# EasyEDA schematic SCH_MdN_Sensor_Contaminacion_Movil_2025-03-27.json

## Sheets
1 Sensor_Cont_Movil_Medialab: TITLE: Sheet_1; REV: 1.0; Date: 2025-01-21; Sheet: 1/1; Company: Your Company
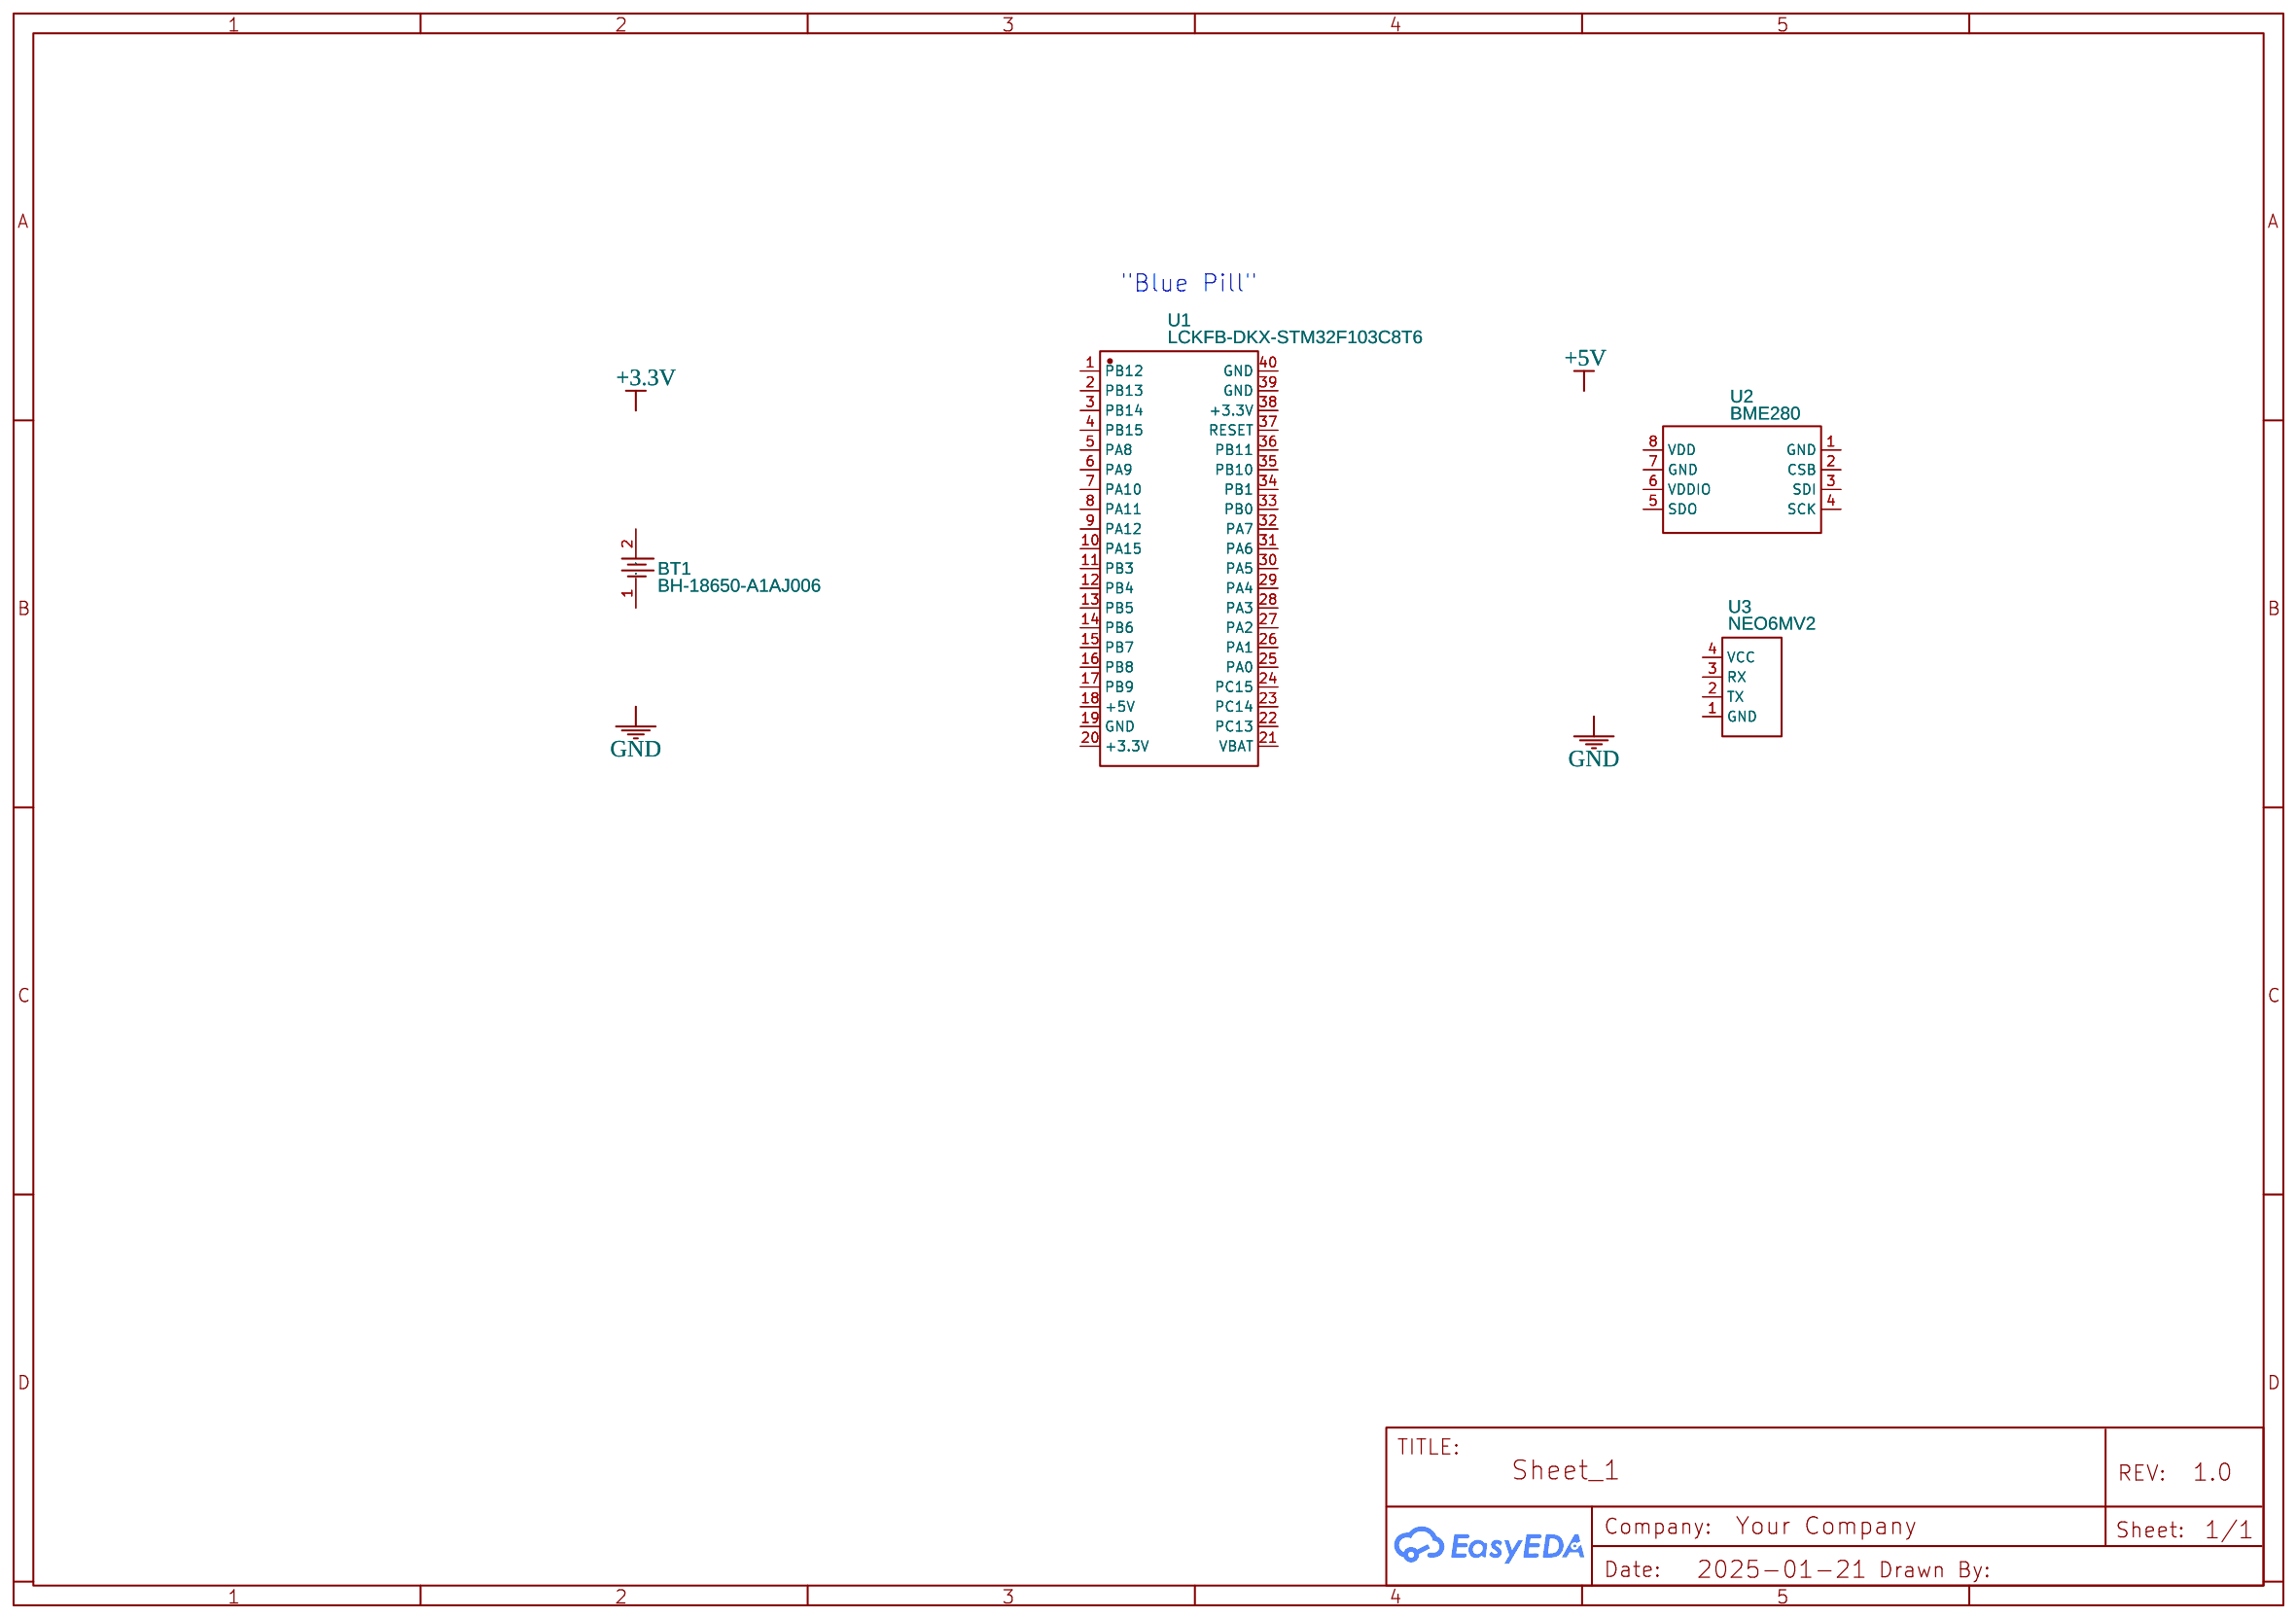
[diagram p0: Sensor_Cont_Movil_Medialab]
2 Sensor_Cont_Movil_MdN
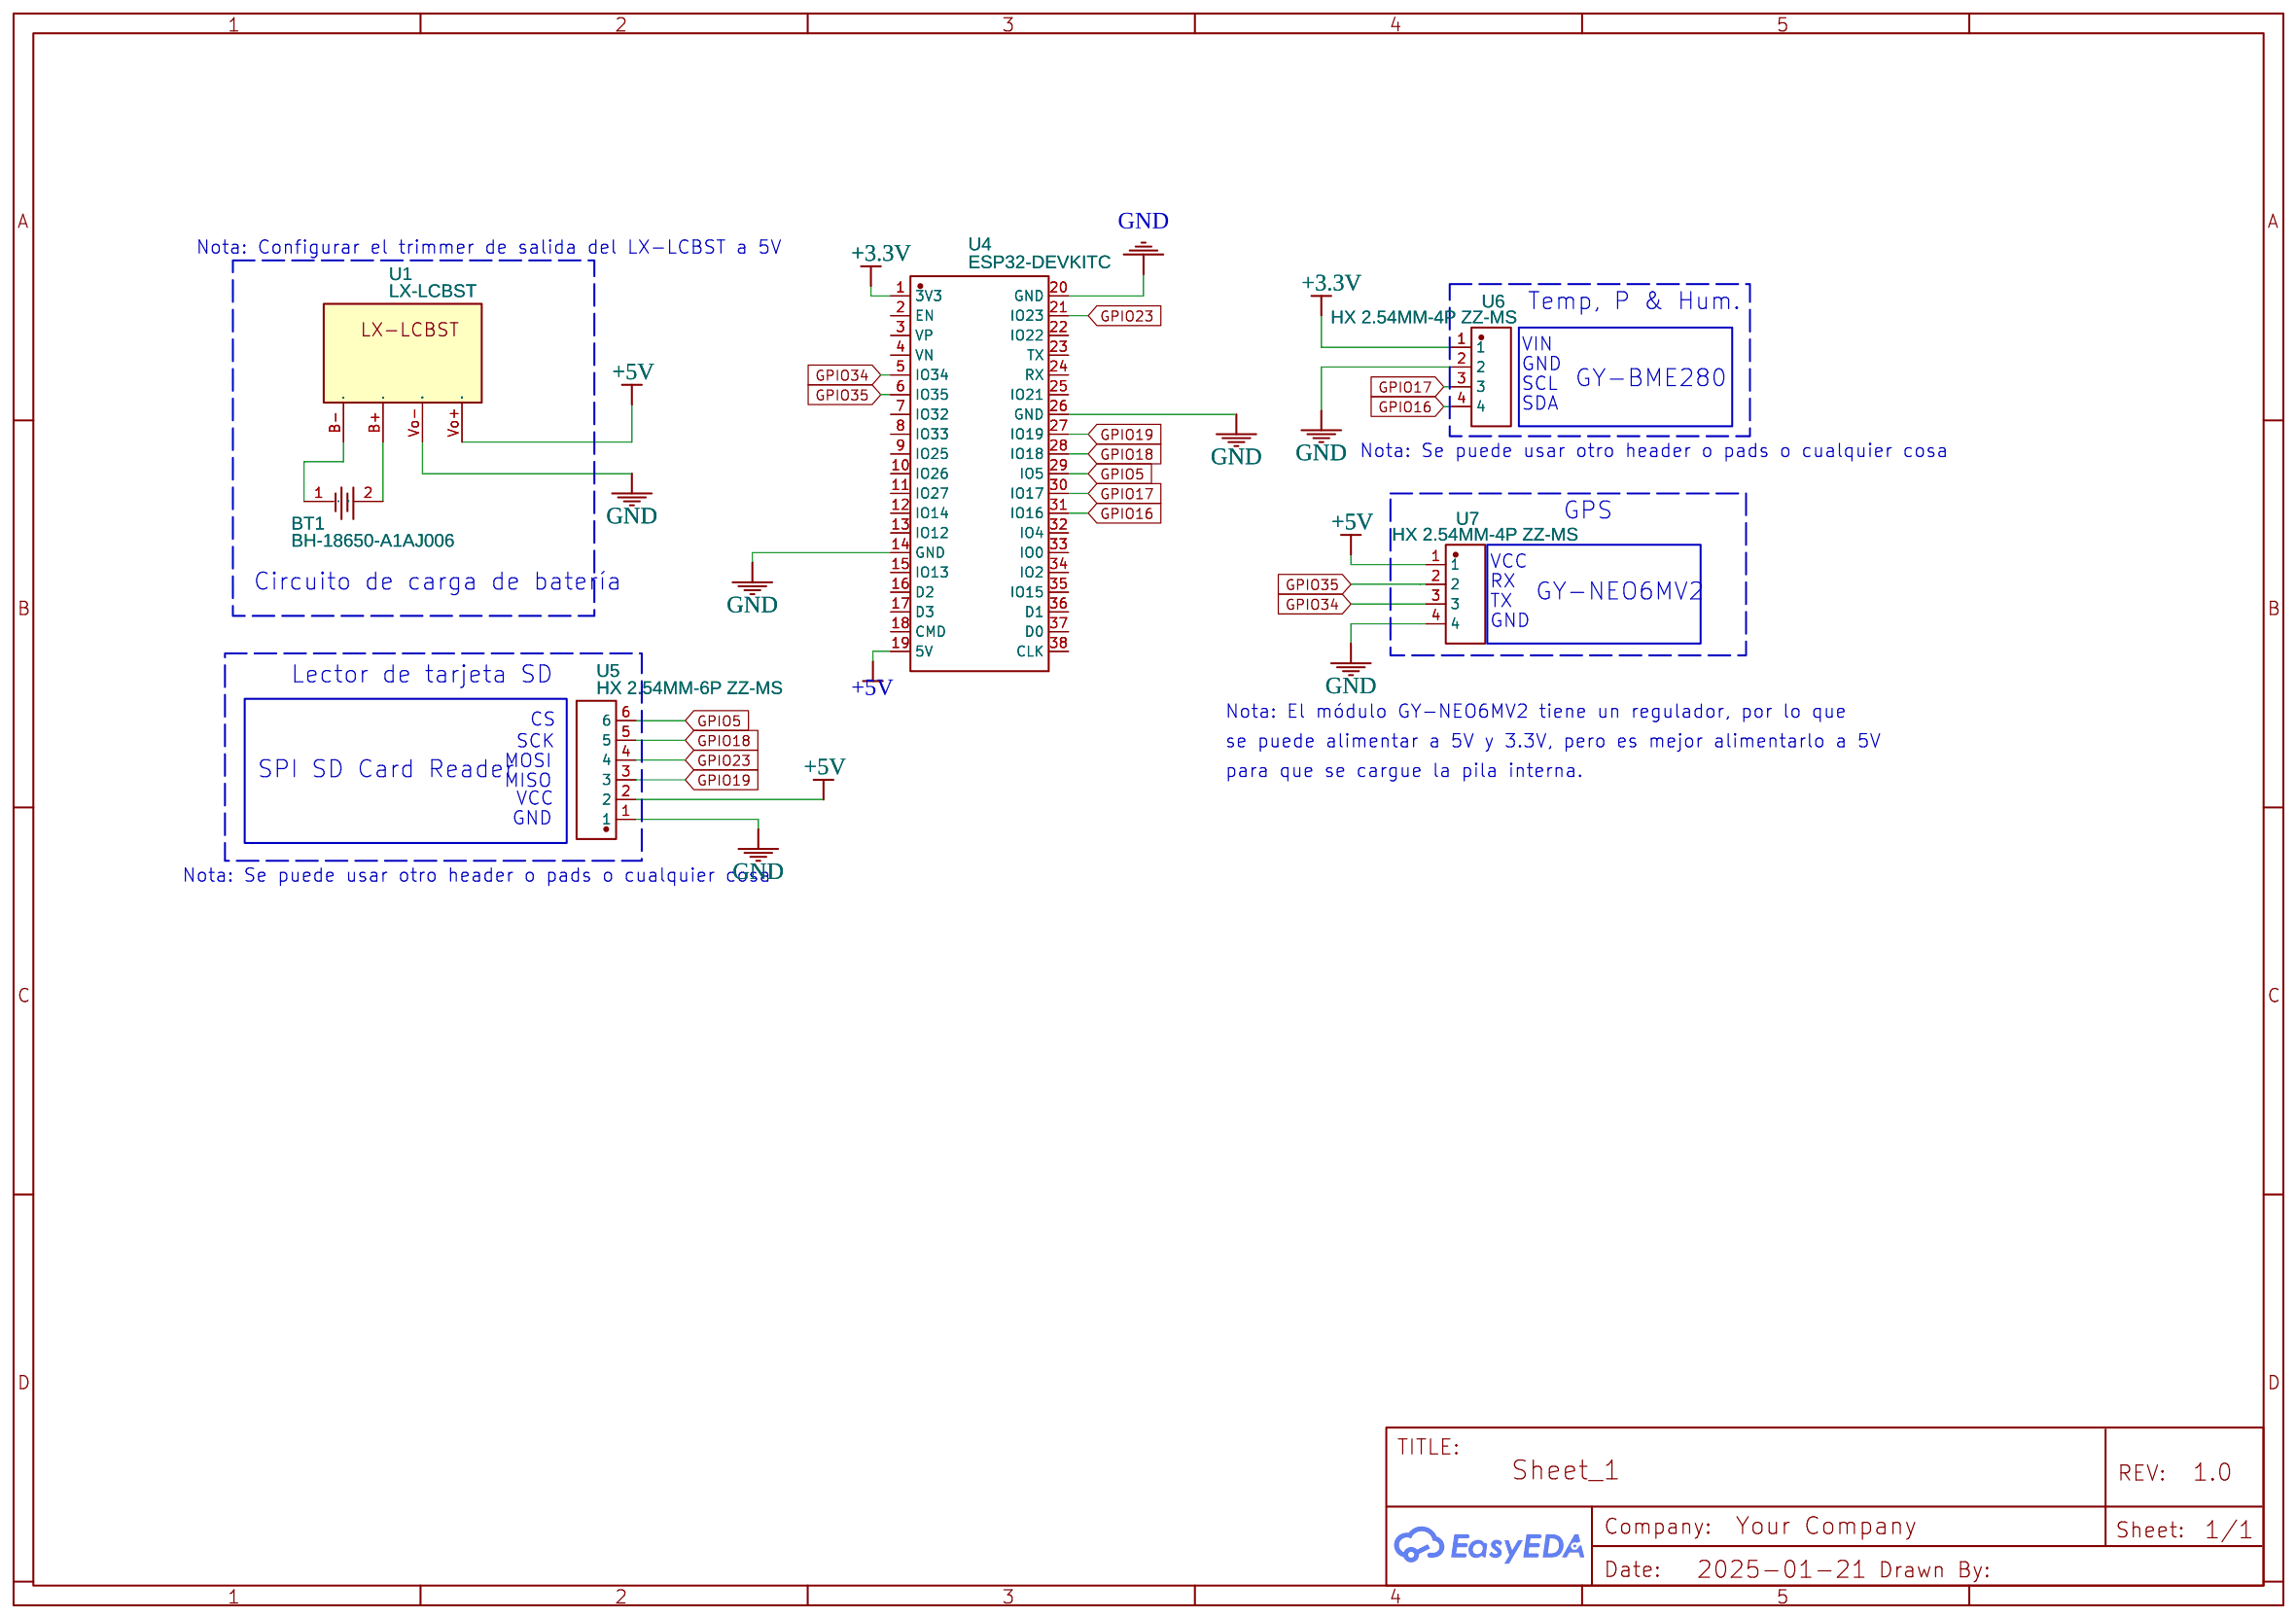
[diagram p1: Sensor_Cont_Movil_MdN]

## Parts
sheet Sensor_Cont_Movil_MdN
BT1#2  BH-18650-A1AJ006  [BAT-TH_BH-18650-A1AJ006]
U1#2  LX-LCBST  [LX-LCBST]
U4  ESP32-DEVKITC  [BULETM-SMD_ESP32-DEVKITC]
U5  HX 2.54MM-6P ZZ-MS  [CONN-TH_6P-P2.50_HX-2.54MM-6P-ZZ-MS]
U6  HX 2.54MM-4P ZZ-MS  [CONN-TH_4P-P2.50_HX-2.54MM-4P-ZZ-MS]
U7  HX 2.54MM-4P ZZ-MS  [CONN-TH_4P-P2.50_HX-2.54MM-4P-ZZ-MS]
sheet Sensor_Cont_Movil_Medialab
BT1  BH-18650-A1AJ006  [BAT-TH_BH-18650-A1AJ006]
U1  LCKFB-DKX-STM32F103C8T6  [CONN-TH_L53.3-W22.9_STM32F103C8T6-CARD]
U2  BME280  [LGA-8_BME280_BL]
U3  NEO6MV2  [GY-NEO6MV2]

## Library data of the parts
BT1 BT1#2 = BH-18650-A1AJ006: Supplier: LCSC; Supplier Part: C5290175; Manufacturer: MYOUNG(美阳); Contributor: lcsc; JLCPCB Part Class: Extended Part
U1#2 = LX-LCBST: Contributor: adrirobot
U4 = ESP32-DEVKITC: Supplier: LCSC; Supplier Part: C571180; Manufacturer: ESPRESSIF(乐鑫); Manufacturer Part: ESP32-DevKitC; Contributor: lcsc; JLCPCB Part Class: Extended Part
U5 = HX 2.54MM-6P ZZ-MS: Supplier: LCSC; Supplier Part: C7543459; Manufacturer: hanxia(韩下); Manufacturer Part: HX 2.54mm-6P ZZ-MS; Contributor: lcsc
U6 U7 = HX 2.54MM-4P ZZ-MS: Supplier: LCSC; Supplier Part: C7543457; Manufacturer: hanxia(韩下); Manufacturer Part: HX 2.54mm-4P ZZ-MS; Contributor: lcsc; JLCPCB Part Class: Extended Part
U1 = LCKFB-DKX-STM32F103C8T6: Supplier: LCSC; Supplier Part: C22396880; Manufacturer: 立创开发板; Contributor: lcsc; JLCPCB Part Class: Extended Part
U2 = BME280: Contributor: LCSC; Supplier: LCSC; Manufacturer: Bosch(博世); Supplier Part: C92489; JLCPCB Part Class: Extended Part
U3 = NEO6MV2: Contributor: norbert-walter

## Nets
+3.3V: U4.1(3V3) U6.1
+5V: U1#2.Vo+(Vout+) U4.19(5V) U5.2 U7.1
GND: U1#2.Vo-(Vout-) U4.14(GND) U4.20(GND) U4.26(GND) U5.1 U6.2 U7.4
GPIO5: U4.29(IO5) U5.6
GPIO16: U4.31(IO16) U6.4
GPIO17: U4.30(IO17) U6.3
GPIO18: U4.28(IO18) U5.5
GPIO19: U4.27(IO19) U5.3
GPIO23: U4.21(IO23) U5.4
GPIO34: U4.5(IO34) U7.3
GPIO35: U4.6(IO35) U7.2
Net-(BT1#2-1): BT1#2.1 U1#2.B-
Net-(BT1#2-2): BT1#2.2 U1#2.B+

Not connected (* = marked no-connect by the designer): BT1 1 2; U1 1(PB12) 2(PB13) 3(PB14) 4(PB15) 5(PA8) 6(PA9) 7(PA10) 8(PA11) 9(PA12) 10(PA15) 11(PB3) 12(PB4) 13(PB5) 14(PB6) 15(PB7) 16(PB8) 17(PB9) 18(+5V) 19(GND) 20(+3.3V) 21(VBAT) 22(PC13) 23(PC14) 24(PC15) 25(PA0) 26(PA1) 27(PA2) 28(PA3) 29(PA4) 30(PA5) 31(PA6) 32(PA7) 33(PB0) 34(PB1) 35(PB10) 36(PB11) 37(RESET) 38(+3.3V) 39(GND) 40(GND); U2 1(GND) 2(CSB) 3(SDI) 4(SCK) 5(SDO) 6(VDDIO) 7(GND) 8(VDD); U3 1(GND) 2(TX) 3(RX) 4(VCC); U4 2(EN) 3(VP) 4(VN) 7(IO32) 8(IO33) 9(IO25) 10(IO26) 11(IO27) 12(IO14) 13(IO12) 15(IO13) 16(D2) 17(D3) 18(CMD) 22(IO22) 23(TX) 24(RX) 25(IO21) 32(IO4) 33(IO0) 34(IO2) 35(IO15) 36(D1) 37(D0) 38(CLK)

## Notes on the sheets
sheet 1
- "Blue Pill"
sheet 2
- Nota: Configurar el trimmer de salida del LX-LCBST a 5V
- Temp, P & Hum.
- VIN
- GND
- GY-BME280
- SCL
- SDA
- Nota: Se puede usar otro header o pads o cualquier cosa
- GPS
- VCC
- Circuito de carga de batería
- RX
- GY-NEO6MV2
- TX
- GND
- Lector de tarjeta SD
- CS
- Nota: El módulo GY-NEO6MV2 tiene un regulador, por lo que
- SCK
- se puede alimentar a 5V y 3.3V, pero es mejor alimentarlo a 5V
- SPI SD Card Reader
- MOSI
- para que se cargue la pila interna.
- MISO
- VCC
- GND
- Nota: Se puede usar otro header o pads o cualquier cosa
